# EasyEDA schematic KitchenExhaustFan.json
TITLE: Sheet_1; REV: 1.0; Date: 2026-08-09; Sheet: 1/1; Drawn By: Ananthapadmanaban gururajan; Company: Your Company
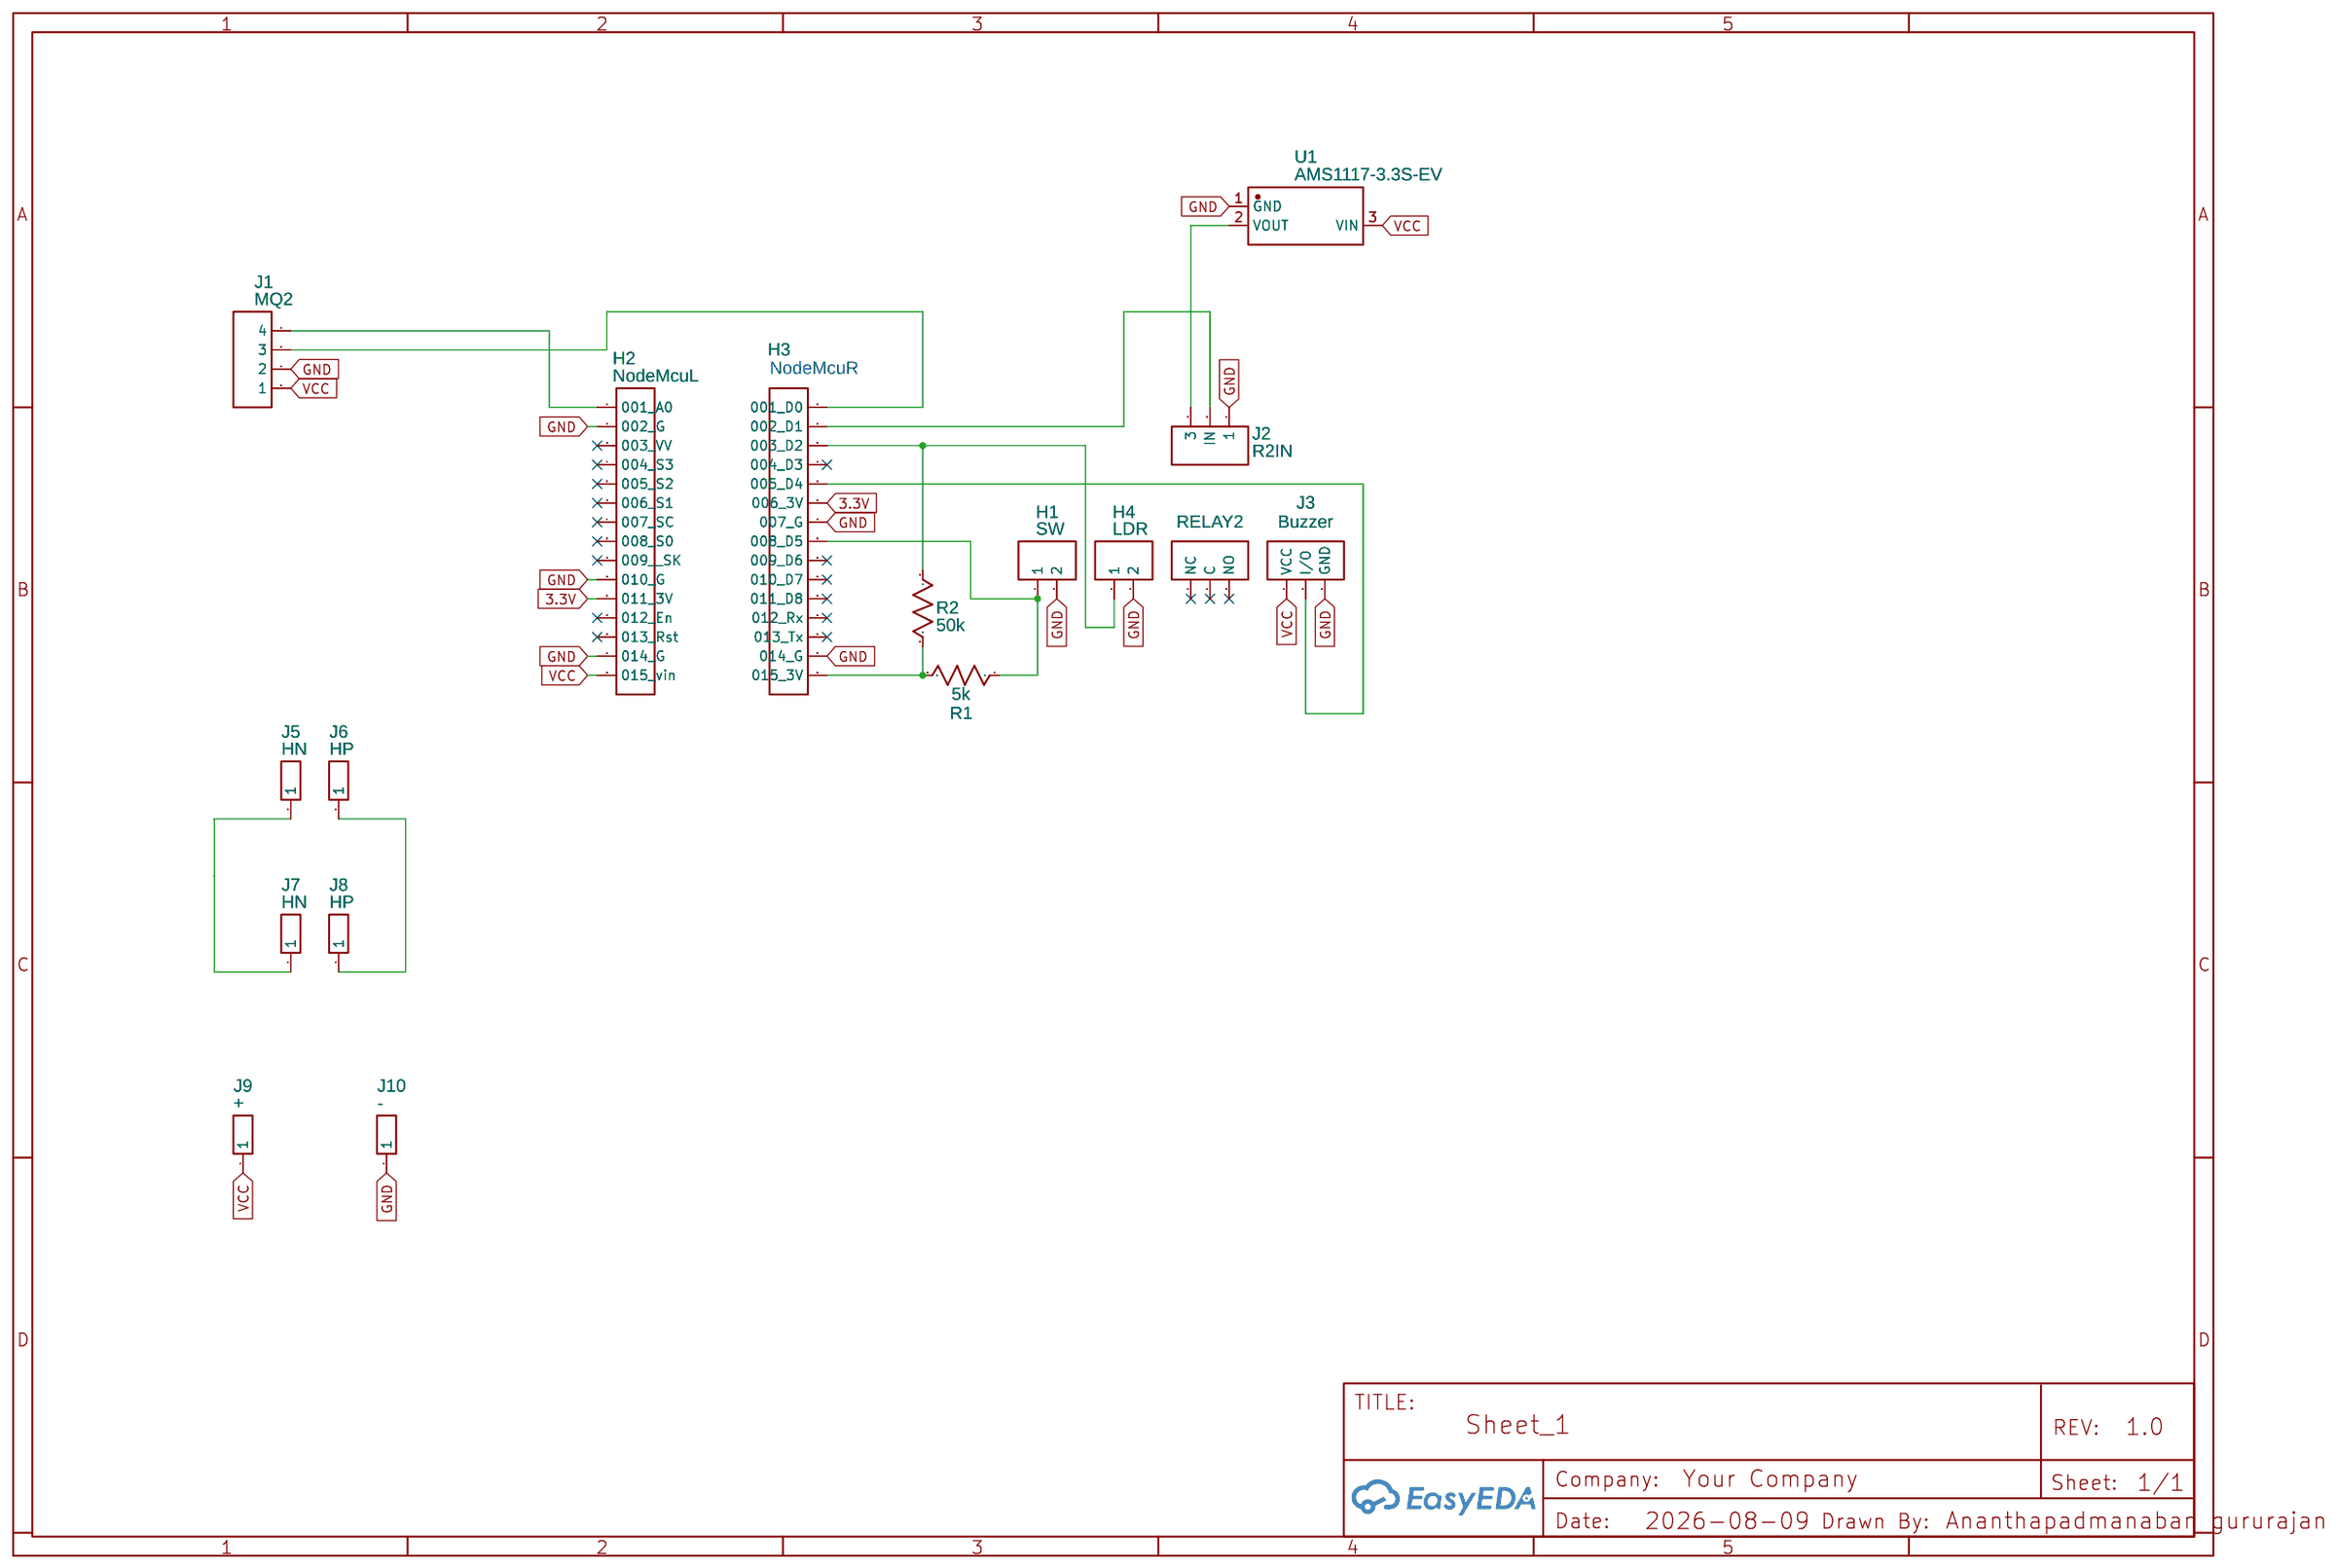
[diagram p0: schematic sheet]

## Parts
H1  SW  [HDR-F-2.54_1X2]
H2  NodeMcuL  [HDR-F-2.54_1X15]
H3  NodeMcuR  [HDR-F-2.54_1X15]
H4  LDR  [HDR-F-2.54_1X2]
J1  MQ2  [HDR-M-2.54_1X4]
J2  R2IN  [HDR-M-2.54_1X3]
J3  Buzzer  [HDR-M-2.54_1X3]
J5  HN  [HDR-M-2.54_1X1]
J6  HP  [HDR-M-2.54_1X1]
J7  HN  [HDR-M-2.54_1X1]
J8  HP  [HDR-M-2.54_1X1]
J9  +  [HDR-M-2.54_1X1]
J10  -  [HDR-M-2.54_1X1]
R1  5k  [R_AXIAL-0.3]
R2  50k  [R_AXIAL-0.3]
RELAY2  Relay1  [HDR-M-2.54_1X3]
U1  AMS1117-3.3S-EV  [SOT-89-3_L4.5-W2.4-P1.50-LS4.0-BR]

## Library data of the parts
H1 H4 = HDR-F-2.54_1x2: Supplier Part: C49661; Supplier: LCSC; Contributor: LCEDA_Lib
H2 H3 = HDR-F-2.54_1x15: Supplier Part: C124408; Supplier: LCSC; Contributor: LCEDA_Lib
J1 = HDR-M-2.54_1x4: Supplier Part: C124378; Supplier: LCSC; Contributor: LCEDA_Lib
J2 J3 RELAY2 = HDR-M-2.54_1x3: Supplier Part: C180248; Supplier: LCSC; Contributor: LCEDA_Lib
J5-J10 = HDR-M-2.54_1x1: Supplier Part: C81276; Supplier: LCSC; Contributor: LCEDA_Lib
R1 R2 = R_AXIAL-0.3_US: Contributor: LCEDA_Lib
U1 = AMS1117-3.3S-EV: Supplier: LCSC; Supplier Part: C28642132; Manufacturer: null; JLCPCB Part Class: Extended Part; Contributor: lcsc

## Nets
3.3V: H2.11(011 3V) H3.6(006 3V)
GND: H1.2 H2.2(002 G) H2.10(010 G) H2.14(014 G) H3.7(007 G) H3.14(014 G) H4.2 J1.2 J2.1 J3.3(GND) J10.1 U1.1(GND)
VCC: H2.15(015 vin) J1.1 J3.1(VCC) J9.1 U1.3(VIN)
Net-(H1-1): H1.1 H3.8(008 D5) R1.1
Net-(H2-1): H2.1(001 A0) J1.4
Net-(H3-1): H3.1(001 D0) J1.3
Net-(H3-2): H3.2(002 D1) J2.2(IN)
Net-(H3-3): H3.3(003 D2) H4.1 R2.1
Net-(H3-5): H3.5(005 D4) J3.2(I/O)
Net-(H3-15): H3.15(015 3V) R1.2 R2.2
Net-(J2-3): J2.3 U1.2(VOUT)
Net-(J5-1): J5.1 J7.1
Net-(J6-1): J6.1 J8.1

Not connected (* = marked no-connect by the designer): H2 3(003 VV)* 4(004 S3)* 5(005 S2)* 6(006 S1)* 7(007 SC)* 8(008 S0)* 9(009  SK)* 12(012 En)* 13(013 Rst)*; H3 4(004 D3)* 9(009 D6)* 10(010 D7)* 11(011 D8)* 12(012 Rx)* 13(013 Tx)*; RELAY2 1(NC)* 2(C)* 3(NO)*

## Notes on the sheet
- NodeMcuR
